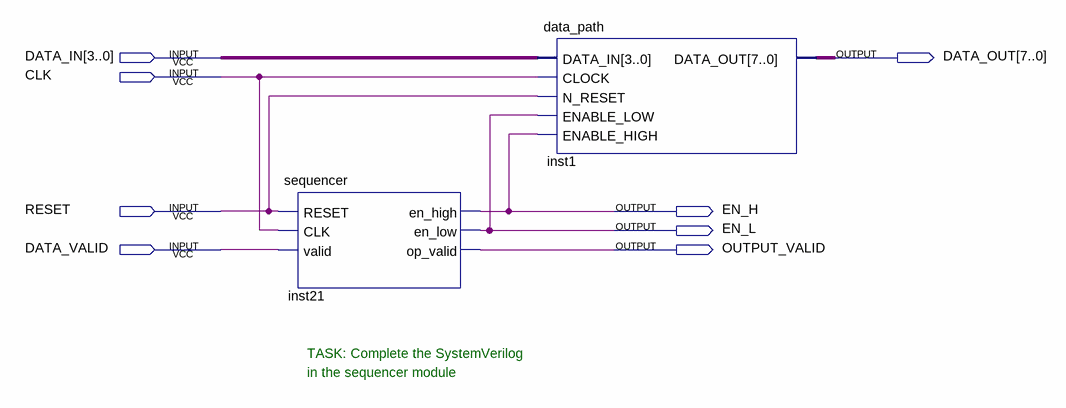
[diagram p0: schematic sheet]
// Quartus schematic four2eight.bdf as structural Verilog: 2 symbols, 8 pins
module four2eight (
  input  [3:0] DATA_IN,
  input  CLK,
  input  RESET,
  input  DATA_VALID,
  output [7:0] DATA_OUT,
  output EN_H,
  output EN_L,
  output OUTPUT_VALID
);

  sequencer inst21 (
    .RESET(RESET), .CLK(CLK), .valid(DATA_VALID), .en_high(EN_H), .en_low(EN_L), .op_valid(OUTPUT_VALID));
  data_path inst1 (
    .DATA_IN(DATA_IN), .CLOCK(CLK), .N_RESET(RESET), .ENABLE_LOW(EN_L), .ENABLE_HIGH(EN_H),
    .DATA_OUT(DATA_OUT));

  // Notes on the sheet:
  //   TASK: Complete the SystemVerilog
  //   in the sequencer module
endmodule
